# Altium schematic sheet Mk.1_2021-11-17.schdoc
size 299 x 199 mm
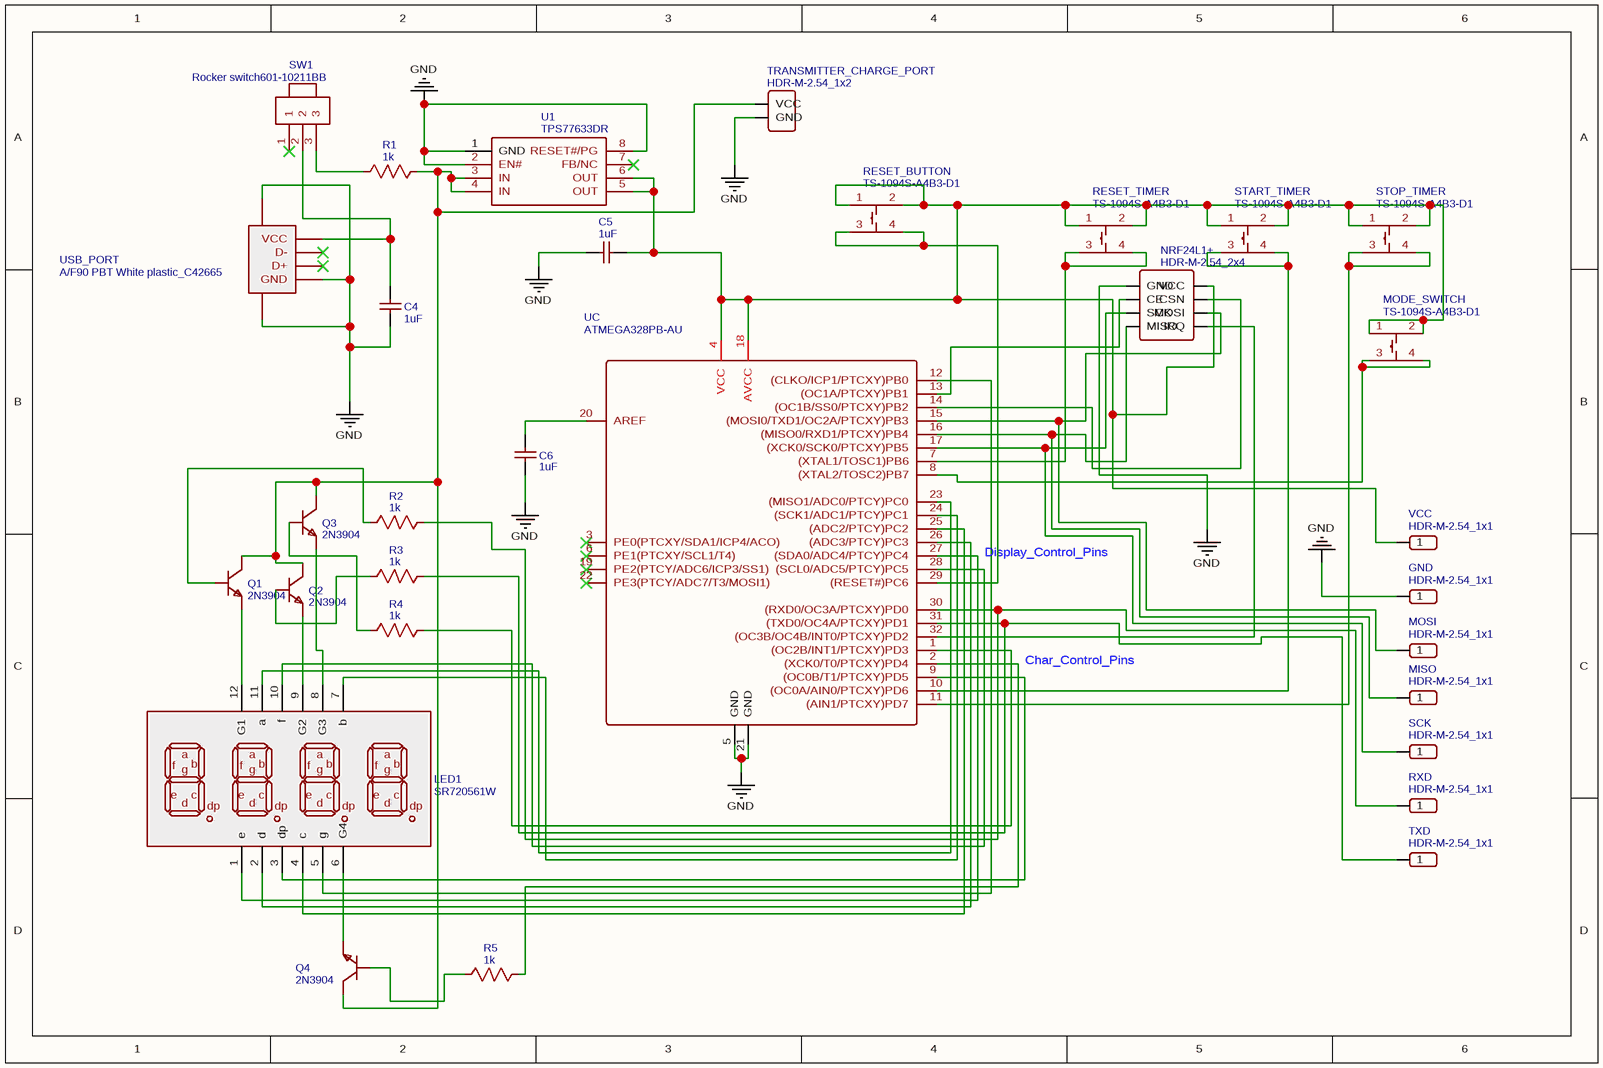
[diagram p0: Mk.1_2021-11-17.schdoc]

## Parts
C4  1uF  [C0603]
C5  1uF  [C0603]
C6  1uF  [C0603]
GND  HDR-M-2.54_1x1  [HDR-M-2.54_1X1]
LED1  SR720561W  [LED-SEG-TH_12P-L50.3-W19.0-P2.54-S15.24-BL]
MISO  HDR-M-2.54_1x1  [HDR-M-2.54_1X1]
MODE_SWITCH  TS-1094S-A4B3-D1  [KEY-SMD_4P-L12.0-W12.0-P5.00-LS15.2]
MOSI  HDR-M-2.54_1x1  [HDR-M-2.54_1X1]
NRF24L1+  HDR-M-2.54_2x4  [HDR-M-2.54_2X4]
Q1  2N3904  [TO-92-3_L5.1-W4.1-P1.27-L]
Q2  2N3904  [TO-92-3_L5.1-W4.1-P1.27-L]
Q3  2N3904  [TO-92-3_L5.1-W4.1-P1.27-L]
Q4  2N3904  [TO-92-3_L5.1-W4.1-P1.27-L]
R1  1k  [R0603]
R2  1k  [R0603]
R3  1k  [R0603]
R4  1k  [R0603]
R5  1k  [R0603]
RESET_BUTTON  TS-1094S-A4B3-D1  [KEY-SMD_4P-L12.0-W12.0-P5.00-LS15.2]
RESET_TIMER  TS-1094S-A4B3-D1  [KEY-SMD_4P-L12.0-W12.0-P5.00-LS15.2]
RXD  HDR-M-2.54_1x1  [HDR-M-2.54_1X1]
SCK  HDR-M-2.54_1x1  [HDR-M-2.54_1X1]
START_TIMER  TS-1094S-A4B3-D1  [KEY-SMD_4P-L12.0-W12.0-P5.00-LS15.2]
STOP_TIMER  TS-1094S-A4B3-D1  [KEY-SMD_4P-L12.0-W12.0-P5.00-LS15.2]
SW1  Rocker switch601-10211BB  [SW-TH_601-10211BB]
TRANSMITTER_CHARGE_PORT  HDR-M-2.54_1x2  [HDR-M-2.54_1X2]
TXD  HDR-M-2.54_1x1  [HDR-M-2.54_1X1]
U1  TPS77633DR  [SOIC-8_L4.9-W3.9-P1.27-LS6.0-BL]
UC  ATMEGA328PB-AU  [TQFP-32_L7.0-W7.0-P0.80-LS9.0-BL]
USB_PORT  A/F90 PBT White plastic_C42665  [USB-A-TH_USB-M-1]
VCC  HDR-M-2.54_1x1  [HDR-M-2.54_1X1]

## Nets
GND: C4.2 C5.2 C6.2 GND.1 NRF24L1+.1(GND) TRANSMITTER_CHARGE_PORT.2(GND) U1.1(GND) U1.2(EN#) U1.8(RESET#/PG) UC.5(GND) UC.21(GND) USB_PORT.4(GND) USB_PORT.5 USB_PORT.6
NetC4_1: C4.1 SW1.2 USB_PORT.1(VCC)
NetC5_1: C5.1 MISO.1 MODE_SWITCH.1 MODE_SWITCH.2 NRF24L1+.2(VCC) NRF24L1+.7(MISO) RESET_BUTTON.1 RESET_BUTTON.2 RESET_TIMER.1 RESET_TIMER.2 START_TIMER.1 START_TIMER.2 STOP_TIMER.1 STOP_TIMER.2 U1.5(OUT) U1.6(OUT) UC.4(VCC) UC.16((MISO0/RXD1/PTCXY)PB4) UC.18(AVCC) VCC.1
NetC6_1: C6.1 UC.20(AREF)
NetLED1_1: LED1.1(e) UC.27((SDA0/ADC4/PTCY)PC4)
NetLED1_2: LED1.2(d) UC.26((ADC3/PTCY)PC3)
NetLED1_3: LED1.3(dp) UC.9((OC0B/T1/PTCXY)PD5)
NetLED1_4: LED1.4(c) UC.25((ADC2/PTCY)PC2)
NetLED1_5: LED1.5(g) UC.12((CLKO/ICP1/PTCXY)PB0)
NetLED1_6: LED1.6(G4) Q4.1(E)
NetLED1_7: LED1.7(b) UC.24((SCK1/ADC1/PTCY)PC1)
NetLED1_8: LED1.8(G3) Q3.1(E)
NetLED1_9: LED1.9(G2) Q2.1(E)
NetLED1_10: LED1.10(f) UC.28((SCL0/ADC5/PTCY)PC5)
NetLED1_11: LED1.11(a) UC.23((MISO1/ADC0/PTCY)PC0)
NetLED1_12: LED1.12(G1) Q1.1(E)
NetMODE_SWITCH_3: MODE_SWITCH.3 MODE_SWITCH.4 UC.8((XTAL2/TOSC2)PB7)
NetMOSI_1: MOSI.1 NRF24L1+.6(MOSI) UC.15((MOSI0/TXD1/OC2A/PTCXY)PB3)
NetNRF24L1+_3: NRF24L1+.3(CE) UC.13((OC1A/PTCXY)PB1)
NetNRF24L1+_4: NRF24L1+.4(CSN) UC.14((OC1B/SS0/PTCXY)PB2)
NetNRF24L1+_5: NRF24L1+.5(SCK) SCK.1 UC.17((XCK0/SCK0/PTCXY)PB5)
NetNRF24L1+_8: NRF24L1+.8(IRQ) UC.32((OC3B/OC4B/INT0/PTCXY)PD2)
NetQ1_2: Q1.2(B) R2.2
NetQ1_3: Q1.3(C) Q2.3(C) Q3.3(C) Q4.3(C) R1.1 TRANSMITTER_CHARGE_PORT.1(VCC) U1.3(IN) U1.4(IN)
NetQ2_2: Q2.2(B) R3.2
NetQ3_2: Q3.2(B) R4.2
NetQ4_2: Q4.2(B) R5.2
NetR1_2: R1.2 SW1.3
NetR2_1: R2.1 RXD.1 UC.30((RXD0/OC3A/PTCXY)PD0)
NetR3_1: R3.1 TXD.1 UC.31((TXD0/OC4A/PTCXY)PD1)
NetR4_1: R4.1 UC.1((OC2B/INT1/PTCXY)PD3)
NetR5_1: R5.1 UC.2((XCK0/T0/PTCXY)PD4)
NetRESET_BUTTON_3: RESET_BUTTON.3 RESET_BUTTON.4 UC.29((RESET#)PC6)
NetRESET_TIMER_3: RESET_TIMER.3 RESET_TIMER.4 UC.7((XTAL1/TOSC1)PB6)
NetSTART_TIMER_3: START_TIMER.3 START_TIMER.4 UC.10((OC0A/AIN0/PTCXY)PD6)
NetSTOP_TIMER_3: STOP_TIMER.3 STOP_TIMER.4 UC.11((AIN1/PTCXY)PD7)

Not connected (* = marked no-connect by the designer): SW1 1*; U1 7(FB/NC)*; UC 3(PE0(PTCXY/SDA1/ICP4/ACO))* 6(PE1(PTCXY/SCL1/T4))* 19(PE2(PTCY/ADC6/ICP3/SS1))* 22(PE3(PTCY/ADC7/T3/MOSI1))*; USB_PORT 2(D-)* 3(D+)*

## Notes on the sheet
- Display_Control_Pins
- Char_Control_Pins

## Library data of the parts
C4-C6 = 1uF: BOM_Manufacturer: FH; BOM_Manufacturer Part: 0603F105M250NT; nameAlias: Capacitance; BOM_Supplier: LCSC; BOM_Supplier Part: C36577; BOM_JLCPCB Part Class: Extended Part; spicePre: C; spiceSymbolName: 0603F105M250NT
GND MISO MOSI RXD SCK TXD VCC = HDR-M-2.54_1x1: Contributor: LCEDA_Lib; BOM_Supplier Part: C81276; BOM_Supplier: LCSC; spicePre: J; spiceSymbolName: HDR-M-2.54_1x1
LED1 = SR720561W: BOM_Manufacturer: Wuxi ARK Tech Elec; Contributor: LCSC; BOM_Supplier: LCSC; BOM_Supplier Part: C111085; BOM_Manufacturer Part: SR720561W; BOM_JLCPCB Part Class: Extended Part; spicePre: L; spiceSymbolName: SR720561W
MODE_SWITCH RESET_BUTTON RESET_TIMER START_TIMER STOP_TIMER = TS-1094S-A4B3-D1: BOM_Manufacturer: Yuandi; Contributor: LCSC; BOM_Supplier: LCSC; BOM_Supplier Part: C492972; BOM_Manufacturer Part: TS-1094S-A4B3-D1; BOM_JLCPCB Part Class: Extended Part; spicePre: S; spiceSymbolName: TS-1094S-A4B3-D1
NRF24L1+ = HDR-M-2.54_2x4: Contributor: LCEDA_Lib; BOM_Supplier Part: C58363; BOM_Supplier: LCSC; spicePre: J; spiceSymbolName: HDR-M-2.54_2x4
Q1-Q4 = 2N3904: BOM_Manufacturer: SEMTECH; BOM_Supplier: LCSC; BOM_Manufacturer Part: 2N3904; BOM_Supplier Part: C118538; BOM_JLCPCB Part Class: Extended Part; spicePre: Q; spiceSymbolName: 2N3904
R1-R5 = 1k: nameAlias: Value(Ω); Contributor: LCEDA_Lib; spicePre: R; spiceSymbolName: R_0603_US
SW1 = Rocker switch601-10211BB: BOM_Manufacturer: BBJ; BOM_Supplier: LCSC; BOM_Manufacturer Part: Rocker switch601-10211BB; BOM_Supplier Part: C67849; spicePre: S; spiceSymbolName: Rocker switch601-10211BB
TRANSMITTER_CHARGE_PORT = HDR-M-2.54_1x2: Contributor: LCEDA_Lib; BOM_Supplier Part: C124375; BOM_Supplier: LCSC; spicePre: J; spiceSymbolName: HDR-M-2.54_1x2
U1 = TPS77633DR: BOM_Manufacturer: TI; BOM_Supplier: LCSC; BOM_Manufacturer Part: TPS77633DR; BOM_Supplier Part: C130078; BOM_JLCPCB Part Class: Extended Part; spicePre: U; spiceSymbolName: TPS77633DR
UC = ATMEGA328PB-AU: BOM_Manufacturer: MICROCHIP; Contributor: LCSC; BOM_Supplier: LCSC; BOM_Manufacturer Part: ATMEGA328PB-AU; BOM_Supplier Part: C132230; BOM_JLCPCB Part Class: Extended Part; spicePre: U; spiceSymbolName: ATMEGA328PB-AU
USB_PORT = A/F90 PBT White plastic_C42665: BOM_Manufacturer: ValuePro; Contributor: 立创EDA官方封装库; BOM_Supplier: LCSC; BOM_Manufacturer Part: A/F90 PBT White plastic; BOM_Supplier Part: C42665; BOM_JLCPCB Part Class: Extended Part; spicePre: U; spiceSymbolName: A/F90 PBT White plastic_C42665